# EAGLE design 454_stereo_mic_Rev020002 (EAGLE 9.6.2)
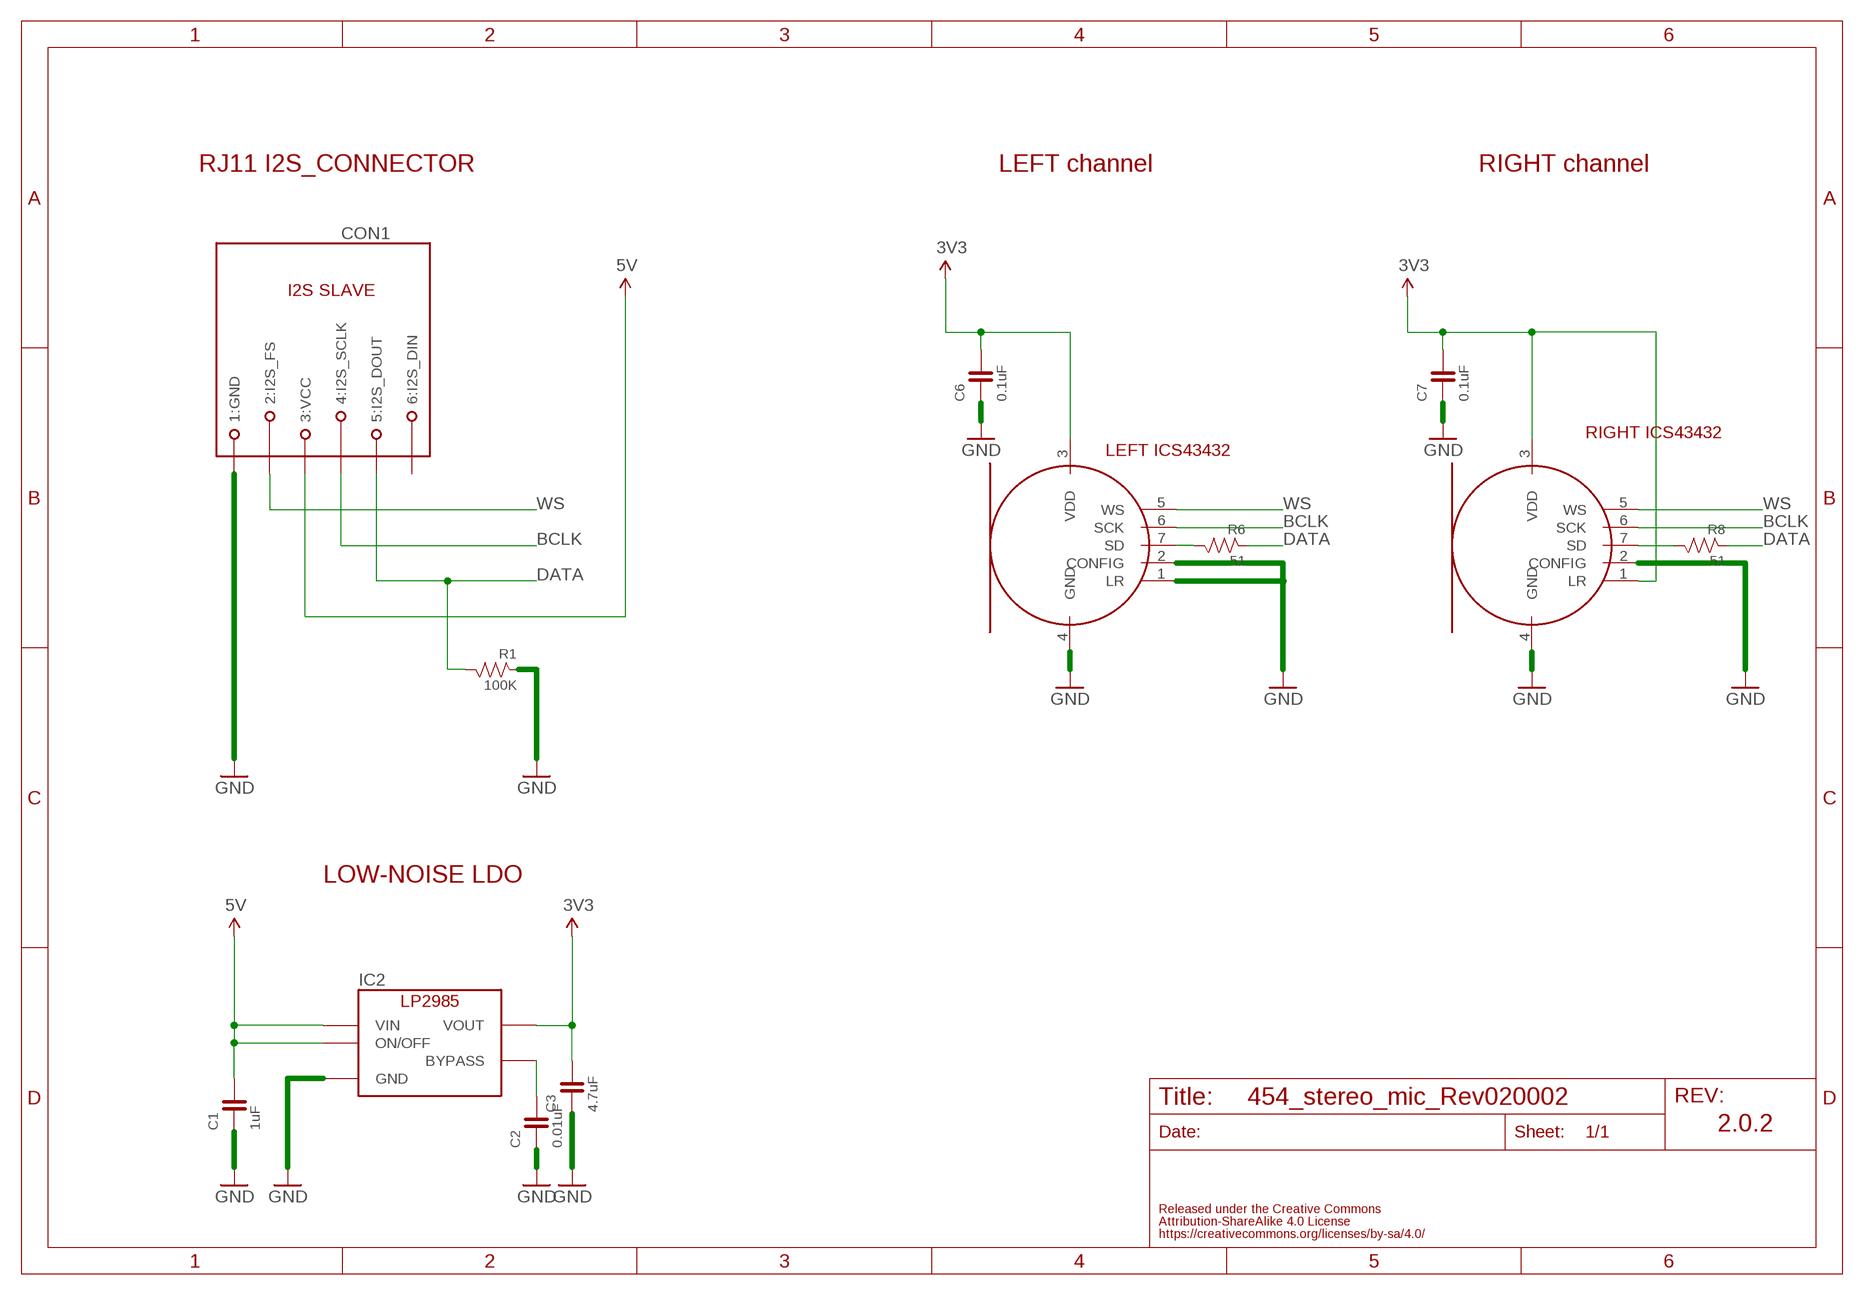
[diagram p0: schematic, sheet 1]

## Parts
C1  1uF  CAPACITOR-0603  [0603]
C2  0.01uF  CAPACITOR-0603  [0603]
C3  4.7uF  CAPACITOR-0603  [0603]
C6  0.1uF  CAPACITOR-0603  [0603]
C7  0.1uF  CAPACITOR-0603  [0603]
CON1  MODULAR-JACK-6P-RJ11_I2S_SLAVE  [7002-6PXC-X]
IC2  LP2985-33DBV  [SOT-23-5]
MIC_LEFT  TDK-ICS43432  [TDK-ICS43432]
MIC_RIGHT  TDK-ICS43432  [TDK-ICS43432]
R1  100K  RESISTOR-0603  [0603]
R6  51  RESISTOR-0603  [0603]
R8  51  RESISTOR-0603  [0603]

## Nets
3V3: C3.2 C6.2 C7.2 IC2.5(VOUT) MIC_LEFT.3(VDD) MIC_RIGHT.1(LR) MIC_RIGHT.3(VDD)
5V: C1.2 CON1.3(3:VCC) IC2.1(VIN) IC2.3(ON/OFF)
BCLK: CON1.4(4:I2S_SCLK) MIC_LEFT.6(SCK) MIC_RIGHT.6(SCK)
DATA: CON1.5(5:I2S_DOUT) R1.2 R6.1 R8.1
GND: C1.1 C2.1 C3.1 C6.1 C7.1 CON1.1(1:GND) IC2.2(GND) MIC_LEFT.1(LR) MIC_LEFT.2(CONFIG) MIC_LEFT.4(GND) MIC_RIGHT.2(CONFIG) MIC_RIGHT.4(GND) R1.1
N$1: C2.2 IC2.4(BYPASS)
N$4: MIC_LEFT.7(SD) R6.2
N$5: MIC_RIGHT.7(SD) R8.2
WS: CON1.2(2:I2S_FS) MIC_LEFT.5(WS) MIC_RIGHT.5(WS)
Unconnected: CON1.6(6:I2S_DIN)

## Notes on the sheet
- RJ11 I2S_CONNECTOR | LEFT channel | RIGHT channel
- RIGHT ICS43432
- LEFT ICS43432
- LOW-NOISE LDO
- 2.0.2

## Library data of the parts
C1-C3 C6 C7 = FaBo-Capacitor:CAPACITOR: CAPACITOR
CON1 = FaBo-Connetor:MODULAR-JACK-6P-RJ11_I2S_SLAVE
IC2 = FaBo-Supply:LP2985: LP2985
MIC_LEFT MIC_RIGHT = FaBo-Mems:TDK-ICS43432
R1 R6 R8 = FaBo-Resistors:RESISTOR: RESISTOR

## Board
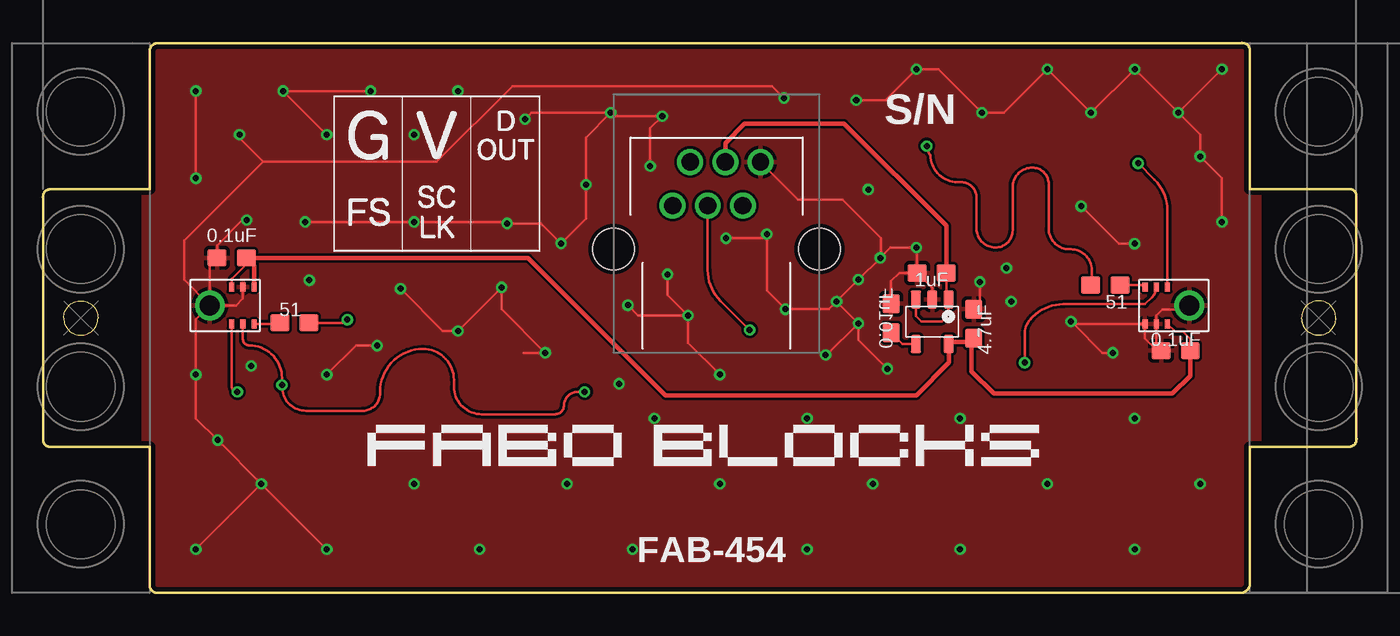
[diagram p1: board, top side]
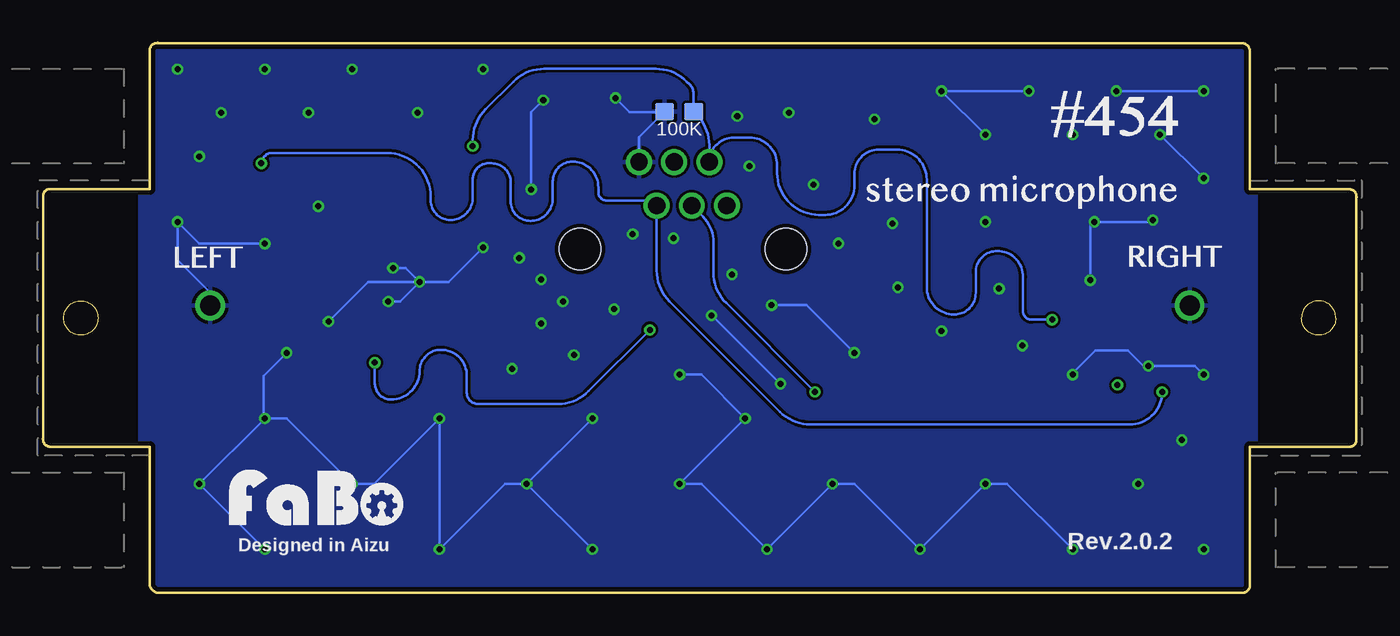
[diagram p2: board, bottom side, seen from below]

Size 76.41 x 32.01 mm. Coordinates in mm from the lower left corner, seen from the top.
Outline: 6.7,32 69.7,32 arc-90 70.2,31.6 70.2,23.5 76,23.5 arc-90 76.4,23.1 76.4,9 arc-90 76,8.5 70.2,8.5 70.2,0.5 arc-90 69.6,0 6.7,0 arc-90 6.2,0.4 6.2,8.5 0.4,8.5 arc-90 0,8.9 0,23 arc-90 0.4,23.5 6.2,23.5 6.2,31.5 arc-90 6.7,32
Outline: 1.2,16 arc-180 3.2,16 arc-180 1.2,16
Outline: 73.2,16 arc180 75.2,16 arc180 73.2,16
Copper layers (1*16): Top 0.035mm / dielectric 1.6mm / Bottom 0.035mm
Design rules "PCBway": minimum track width 6mil, minimum drill 12mil, track to track 6mil, track to pad 6mil, pad to pad 6mil, via to via 6mil, smd to smd 6mil, copper to edge 10mil, drill to drill 10mil, minimum pad ring 10mil, minimum via ring 6mil, stop-mask expansion 2mil, vias tented up to drill 100mil, thermal gap 8mil
tRestrict: area -2.9,6.1 to 5.7,25.8; area 70.9,6.9 to 79.5,26.6
bRestrict: area 70.9,6.5 to 79.5,26.2; area -2.9,5.7 to 5.7,25.4

### Footprints (pad centres in the part's own frame; a part is rotated, then mirrored left to right if it is on the bottom)
0603 = smd 1.1 x 1: 1 -0.85,0; 2 0.85,0
7002-6PXC-X = drill 1: 1 2.55,5.08; 2 1.53,2.54; 3 0.51,5.08; 4 -0.51,2.54; 5 -1.53,5.08; 6 -2.55,2.54 | hole 2.4: -6,0; 6,0
SOT-23-5 = smd 0.6 x 1.05: 1 -0.95,-1.3; 2 0,-1.3; 3 0.95,-1.3; 4 0.95,1.3; 5 -0.95,1.3
TDK-ICS43432 = smd 0.5 x 0.3: 1 1.075,-2.575; 2 1.075,-1.925; 3 1.075,-1.275; 5 -1.075,-1.275; 6 -1.075,-1.925; 7 -1.075,-2.575 | drill 1.15 pad 1.65: 4 0,0

### Placement (x,y rotation side)
C1  51.69,18.62 0 top
C2  49.34,15.99 270 top
C3  54.14,15.67 270 top
C6  10.98,19.5 0 top
C7  65.89,14.1 0 top
CON1  39.18,20 0 top
IC2  51.73,15.78 180 top
MIC_LEFT  66.68,16.73 270 top
MIC_RIGHT  9.7,16.73 90 top
R1  39.4,28 0 bottom
R6  61.8,17.92 0 top
R8  14.63,15.72 180 top
U$2  [4-1BLOCK]  2.2,16 0 top
U$3  [4-1BLOCK]  74.2,16 180 top
U$4  [LOGO_FABO_M]  60.51,3.56 0 bottom

### Tracks (layer width: path | path; a pad name or v marks a point on that pad's centre or on a via)
3V3
  Top 0.152: MIC_LEFT.3 65.85,15.2 66.3,15.2 66.74,14.77 C7.2 | 12.28,19.05 11.87,19.46 | 11.87,19.46 C6.2 | MIC_RIGHT.3 10.98,18.28 11.87,19.17 11.87,19.46 | 52.7,14.48 IC2.5 | 53.8,14.48 54.01,14.69 54.11,14.79 | 54.11,14.79 C3.2 | 54.11,14.6 54.11,14.79
  Top 0.254: IC2.5 52.8,14.6 54.11,14.6 | C7.2 66.74,12.64 65.7,11.6 55.3,11.6 54.01,12.89 54.01,14.69 | MIC_RIGHT.1 12.28,19.05 C6.2 28.2,19.5 36.2,11.5 50.8,11.5 52.7,13.4 52.7,14.48
5V
  Top 0.152: C1.2 52.54,18.5 52.54,17.22 IC2.1 52.68,16.18 52.3,15.8 51.1,15.8 50.78,16.13 IC2.3
  Top 0.254: CON1.3 39.69,26.19 40.8,27.3 46.6,27.3 52.54,21.37 52.54,18.5
BCLK  (via drill 0.35)
  Top 0.152: v41.1,15.3 39.41,16.99 arc-45 38.67,18.79 CON1.4 | MIC_LEFT.6 arc-45 64.51,17.21 64.1,16.8 59.35,16.8 arc45 57.56,16.06 57.5,16 arc45 57.1,15.04 v57.1,13.4 | MIC_RIGHT.6 11.63,14.78 arc90 12,14.4 arc-90 13.9,12.5 v13.9,12.1 13.9,12 arc90 15.3,10.6 18.6,10.6 arc90 19.6,11.6 19.6,11.7 arc-90 22.1,14.2 arc-90 23.9,12.4 23.9,12 arc90 25.5,10.4 29.8,10.4 arc90 30.3,10.9 arc-90 31.1,11.7 v31.5,11.7
  Bottom 0.152: CON1.4 38.02,21.9 arc45 37.4,20.4 37.4,18.65 arc-45 36.66,16.86 v31.5,11.7 | v57.1,13.4 57.1,12.2 arc-90 56.15,11.25 arc-90 54.5,12.9 arc90 53.25,14.15 arc90 51.75,12.65 51.75,11.65 arc-90 51.1,11 46.45,11 arc-45 44.66,11.75 v41.1,15.3
DATA  (via drill 0.35)
  Top 0.152: v51.4,26 arc45 51.61,25.49 arc90 53.2,23.9 53.4,23.9 arc-90 54.3,23 54.3,21.2 arc90 55.4,20.1 arc90 56.4,21.1 56.4,23.6 arc-90 57.55,24.75 arc-90 58.5,23.8 58.5,21.2 arc90 59.7,20 59.8,20 arc-90 61,18.8 61,18.02 arc-90 60.9,17.92 R6.1 | R8.1 17.52,15.72 arc90 v17.7,15.9
  Bottom 0.152: CON1.5 37.65,25.2 | v51.4,26 51.4,26.35 arc45 50.66,28.15 49.05,29.76 arc45 47.25,30.5 40.75,30.5 arc45 38.96,29.76 38.8,29.6 arc45 38.55,29 R1.2 38.39,27.84 arc45 37.65,26.05 CON1.5 | CON1.5 arc90 36.23,26.5 35.3,26.5 arc90 33.7,24.9 33.7,24.44 arc-90 31.26,22 30.9,22 arc-90 29.2,23.7 29.2,24.4 arc90 27.8,25.8 26.74,25.8 arc90 25,24.06 25,17.8 arc-90 23.4,16.2 arc-90 22.15,17.45 22.15,18.65 arc90 20.9,19.9 arc90 19.4,18.4 19.4,16.4 arc-90 18.9,15.9 v17.7,15.9
GND  (via drill 0.35)
  Top 0.152: MIC_RIGHT.4 9.7,19.08 C6.1 10.13,20.23 11.59,21.69 v11.84,21.69 | MIC_RIGHT.2 11.63,17.13 11.23,16.73 MIC_RIGHT.4 | C2.1 49.34,18.14 49.82,18.62 C1.1 | IC2.2 51.73,17.73 C1.1 | C3.1 54.5,16.88 v54.5,18.1 | 48.75,19.55 49.3,20.1 v50.8,20.1 50.84,20.07 C1.1 | 48.75,19.55 v48.7,19.5 v47.43,18.23 v46.16,16.96 | MIC_LEFT.4 66.45,16.5 65.1,16.5 64.75,16.15 MIC_LEFT.2 64.75,14.38 C7.1 64.81,14.1 64.1,14.8 MIC_LEFT.1 59.95,15.65 | CON1.1 43.91,22.9 46.5,22.9 48.75,20.65 48.75,19.55 | 59.95,15.65 v59.8,15.8 | MIC_RIGHT.4 8.2,18.23 8.2,20.5 12.8,25.1 | v43.1,28.8 42.4,29.5 27.3,29.5 22.9,25.1 12.8,25.1 | 12.8,25.1 11.43,26.47 v11.43,26.67 | v8.89,24.13 v8.89,29.21 | v19.05,29.21 v13.97,29.21 v16.51,26.67 | v8.89,2.54 v12.7,6.35 | v12.7,6.35 v16.51,2.54 | v12.7,6.35 v10.16,8.89 8.89,10.16 v8.89,12.7 8.89,15.92 MIC_RIGHT.4 | v16.51,12.7 18.2,14.39 v19.44,14.39 | v20.79,17.7 23.25,15.24 v24.13,15.24 v26.67,17.78 26.67,16.51 v29.21,13.97 27.94,13.97 | v15.24,21.59 v21.59,21.59 26.9,21.59 v26.99,21.5 28.97,21.5 v30.13,20.34 31.58,21.79 v31.58,23.76 31.58,26.5 v33.02,27.94 | v28.04,27.57 28.41,27.94 v33.02,27.94 | v39.37,12.7 37.52,14.55 v37.52,16.14 | v37.52,16.14 34.62,16.14 v34.02,16.74 | v62.23,13.97 61.63,13.97 59.95,15.65 | v47.3,28.68 49,28.68 v50.8,30.48 52.07,30.48 v54.61,27.94 55.88,27.94 v58.42,30.48 v60.96,27.94 v63.5,30.48 v66.04,27.94 | v66.04,27.94 v68.58,30.48 | v66.04,27.94 67.31,26.67 v67.31,25.4 68.58,24.13 v68.58,21.59 | v60.39,22.5 62.57,20.32 v63.5,20.32 | v37.52,16.14 36.32,17.34 v36.32,18.54 | v39.72,20.64 41.86,20.64 v42.1,20.88 42.1,17.59 v43.18,16.51 45.71,16.51 v46.16,16.96
  Top 0.152: v46.16,16.96 v47.43,15.69 | v47.43,15.69 45.58,13.84 v45.52,13.84 | v47.43,15.69 47.43,14.73 v49.12,13.04 | v35.32,24.84 35.32,27.04 v36.02,27.74 33.22,27.74 v33.02,27.94
  Bottom 0.152: CON1.1 41.73,26.53 40.28,27.98 | 40.28,27.98 R1.1 | v54.5,18.1 52.8,18.1 v50.8,20.1 | v59.8,15.8 57.5,18.1 v54.5,18.1 | v43.1,28.8 42.28,27.98 40.28,27.98 | v11.43,26.67 v8.89,24.13 | v8.89,29.21 v13.97,29.21 | v19.05,29.21 v24.13,29.21 v21.59,26.67 | v8.89,12.7 9.39,13.2 v12.11,13.2 12.4,13.2 13.3,14.1 15.2,14.1 16.51,12.79 v16.51,12.7 | v15.49,18.2 15.49,21.34 v15.24,21.59 11.94,21.59 v11.84,21.69 | v29.21,13.97 31.98,16.74 v34.02,16.74 | v16.51,2.54 20.32,6.35 v21.59,6.35 v25.4,2.54 29.21,6.35 v30.48,6.35 v34.29,2.54 38.1,6.35 v39.37,6.35 v35.56,10.16 38.1,12.7 v39.37,12.7 | v33.51,12.17 37.48,16.14 v37.52,16.14 | v44.45,2.54 v48.26,6.35 | v48.26,6.35 v44.45,10.16 | v48.26,6.35 49.53,6.35 v53.34,2.54 v53.34,10.16 57.15,6.35 v58.42,6.35 62.23,10.16 v63.5,10.16 63.58,10.08 | 63.58,10.08 v67.31,6.35 v63.5,2.54 | v62.23,13.97 63.58,12.62 63.58,10.08 | v54.5,18.1 55.3,18.9 v56.05,18.9 | v56.32,16.96 55.64,16.96 v54.5,18.1 | v48,23.48 48,27.98 v47.3,28.68 | v63.5,20.32 67.31,20.32 v68.58,21.59 68.58,19.38 66.68,17.48 MIC_LEFT.4
  pour Top (rank 6): -3.57,-1.95 78.18,-1.95 78.18,36.63 -3.57,36.63
  pour Bottom (rank 6): -5.12,-3.25 79.81,-3.25 79.81,35.33 -5.12,35.33
N$1
  Top 0.152: IC2.4 50,14.48 C2.2
N$4
  Top 0.152: R6.2 63.82,17.92 arc-45 MIC_LEFT.7
N$5
  Top 0.152: R8.2 13.71,15.65 MIC_RIGHT.7
WS  (via drill 0.35)
  Top 0.152: v63.7,25 64.66,24.05 arc-45 65.4,22.25 MIC_LEFT.5 | v11.3,11.7 arc-90 10.98,12.03 MIC_RIGHT.5
  Bottom 0.152: v63.7,25 63.64,25.07 arc90 63.1,25.6 56.39,25.6 arc90 53.85,23.06 53.85,22.85 arc-90 52.7,21.7 arc-90 51.4,23 51.4,24.1 arc90 50.5,25 50.3,25 arc90 49.2,23.9 49.2,22.8 arc-90 48.05,21.65 arc-90 46.75,22.95 46.75,23.95 arc90 45.6,25.1 arc90 44.1,23.6 44.1,23.3 arc-90 43.64,22.84 41.01,22.84 CON1.2 40.71,18.76 arc-45 39.96,16.96 33.55,10.55 arc-45 31.75,9.8 13.2,9.8 arc-90 v11.3,11.7

### Text on the board
tPlace: S/N | FAB-454
bPlace: Rev.2.0.2 | Designed in Aizu
Document: #454 Stereo Microphone / Rev2.0.2 / 2023/08/16